# Altium schematic sheet LEDsButtons.SchDoc
size A
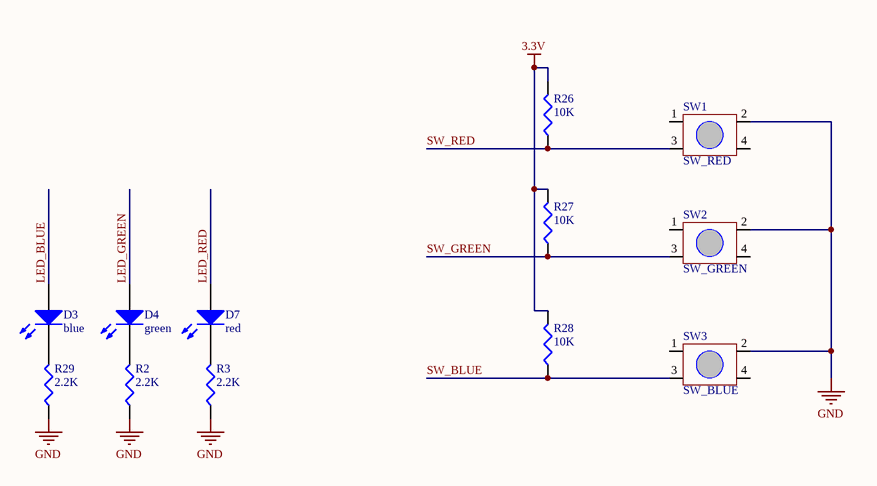
[diagram p0: LEDsButtons.SchDoc]

## Parts
D3  blue  [SurfaceMount(603)]
D4  green  [SurfaceMount(603)]
D7  red  [SurfaceMount(603)]
R2  value 2.2K  [J1-0603]  (hidden comment: Res3)
R3  value 2.2K  [J1-0603]  (hidden comment: Res3)
R26  value 10K  [J1-0603]  (hidden comment: Res3)
R27  value 10K  [J1-0603]  (hidden comment: Res3)
R28  value 10K  [J1-0603]  (hidden comment: Res3)
R29  value 2.2K  [J1-0603]  (hidden comment: Res3)
SW1  SW_RED  [SwitchTall-TL330]
SW2  SW_GREEN  [SwitchTall-TL330]
SW3  SW_BLUE  [SwitchTall-TL330]

## Nets
3.3V: R26.2 R27.2 R28.2
GND: R2.1 R3.1 R29.1 SW1.2 SW2.2 SW3.2
LED_BLUE: D3.1(A)
LED_GREEN: D4.1(A)
LED_RED: D7.1(A)
SW_BLUE: R28.1 SW3.3
SW_GREEN: R27.1 SW2.3
SW_RED: R26.1 SW1.3
NetD3_2: D3.2(K) R29.2
NetD4_2: D4.2(K) R2.2
NetD7_2: D7.2(K) R3.2

Not connected (* = marked no-connect by the designer): SW1 1 4; SW2 1 4; SW3 1 4

## Library data of the parts
D3 D4 D7 = LED
R2 R3 R26-R29 = Res3: Resistor; Published: 8-Jun-2000; LatestRevisionDate: 29-May-2009; LatestRevisionNote: IPC-7351 Footprint Added.; PackageReference: J1-0603; Publisher: Altium Limited; PackageDescription: Chip Resistor
SW1-SW3 = Switch-TL330